# Altium project Design.PrjPcb
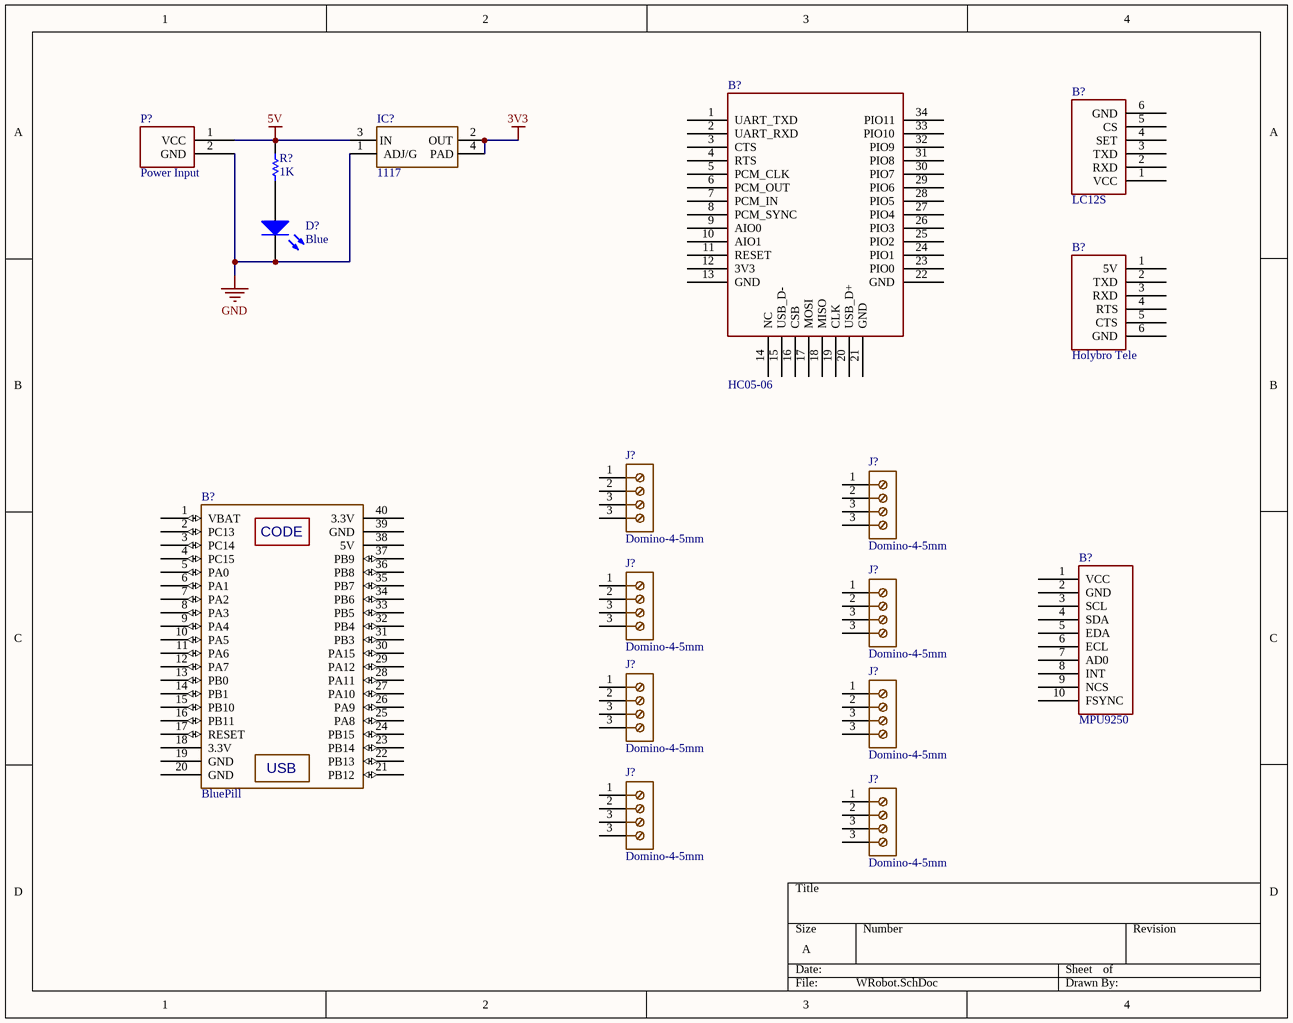
[diagram p0: WRobot.SchDoc]
1 sheet, 17 parts. Net scope: global (net labels, ports and power ports of the same name join across sheets).
Board file: WRobot.PcbDoc

## Sheet WRobot.SchDoc
size A

### Parts
(Parts that share a designator on the sheet are numbered #1, #2 ... from top to bottom, then left to right.)
B?#1  LC12S  [LC12S]
B?#2  Holybro Tele  [HOLYBRO_TELE]
B?#3  HC05-06  [HC05-06]
B?#4  MPU9250  [MPU9250]
B?#5  BluePill  [BlUEPILL]
D?  value Blue  [LED-3mm]  (hidden comment: LED-BLUE-TH-3mm)
IC?  1117  [SOT223]
J?#1  Domino-4-5mm  [DOMINO-4-5MM]
J?#2  Domino-4-5mm  [DOMINO-4-5MM]
J?#3  Domino-4-5mm  [DOMINO-4-5MM]
J?#4  Domino-4-5mm  [DOMINO-4-5MM]
J?#5  Domino-4-5mm  [DOMINO-4-5MM]
J?#6  Domino-4-5mm  [DOMINO-4-5MM]
J?#7  Domino-4-5mm  [DOMINO-4-5MM]
J?#8  Domino-4-5mm  [DOMINO-4-5MM]
P?  Power Input  [POWER_INPUT]
R?  value 1K  [RES-SM-0805]  (hidden comment: Res-1K-0805)

### Nets
3V3: IC?.2(OUT) IC?.4(PAD)
5V: IC?.3(IN) P?.1(VCC) R?.2
GND: D?.2(K) IC?.1(ADJ/G) P?.2(GND)
NetD?_1: D?.1(A) R?.1

Not connected (* = marked no-connect by the designer): B?#1 1(VCC) 2(RXD) 3(TXD) 4(SET) 5(CS) 6(GND); B?#2 1(5V) 2(TXD) 3(RXD) 4(RTS) 5(CTS) 6(GND); B?#3 1(UART_TXD) 2(UART_RXD) 3(CTS) 4(RTS) 5(PCM_CLK) 6(PCM_OUT) 7(PCM_IN) 8(PCM_SYNC) 9(AIO0) 10(AIO1) 11(RESET) 12(3V3) 13(GND) 14(NC) 15(USB_D-) 16(CSB) 17(MOSI) 18(MISO) 19(CLK) 20(USB_D+) 21(GND) 22(GND) 23(PIO0) 24(PIO1) 25(PIO2) 26(PIO3) 27(PIO4) 28(PIO5) 29(PIO6) 30(PIO7) 31(PIO8) 32(PIO9) 33(PIO10) 34(PIO11); B?#4 1(VCC) 2(GND) 3(SCL) 4(SDA) 5(EDA) 6(ECL) 7(AD0) 8(INT) 9(NCS) 10(FSYNC); B?#5 1(VBAT) 2(PC13) 3(PC14) 4(PC15) 5(PA0) 6(PA1) 7(PA2) 8(PA3) 9(PA4) 10(PA5) 11(PA6) 12(PA7) 13(PB0) 14(PB1) 15(PB10) 16(PB11) 17(RESET) 18(3.3V) 19(GND) 20(GND) 21(PB12) 22(PB13) 23(PB14) 24(PB15) 25(PA8) 26(PA9) 27(PA10) 28(PA11) 29(PA12) 30(PA15) 31(PB3) 32(PB4) 33(PB5) 34(PB6) 35(PB7) 36(PB8) 37(PB9) 38(5V) 39(GND) 40(3.3V); J?#1 1 2 3; J?#2 1 2 3; J?#3 1 2 3; J?#4 1 2 3; J?#5 1 2 3; J?#6 1 2 3; J?#7 1 2 3; J?#8 1 2 3

### Notes on the sheet
- (in symbol BluePill) CODE; USB

### Library data of the parts
D? = LED-BLUE-TH-3mm: LED BLUE CLEAR T-1 T/H; Manufacturer: Kingbright; Manufacturer Part Number: WP710A10QBC/D; Local Supplier: thegioiic; Local Supplier Link: https://thegioiic.com/products/led-xanh-duong-3mm-chan-dai; Supplier 1: Digikey; Supplier 1 Link: https://www.digikey.com/product-detail/en/kingbright/WP710A10QBC-D/754-1596-ND/2769812; Supplier 1 Part Number: 754-1596-ND
IC? = 1117: Available in 1.8V, 2.5V, 2.85V, 3.3V, 5V, and  Adjustable Versions; Value: LM317
J?#1-J?#8 = Domino-4-5mm: WR-TBL Serie 1347 Horizontal Cable Entry, Pressure Clamp, pitch 5mm, 3p; Part Number: 691134710003; Compliance: Lead free / RoHS; Modularity: Yes; PCB/Cable/Panel: PCB; Pin Number: 3; Rated Current [UL]: 16A; Working Voltage [UL]: 300VAC; ComponentLink1Description: Manufacturer; ComponentLink1URL: http://www.we-online.de; ComponentLink2URL: https://katalog.we-online.de/em/datasheet/691134710003.pdf; ComponentLink2Description: Datasheet; Mounting Technology: THT; Packaging: Box; Operating Temperature: -30 to +120degC; Pitch: 5mm; Published Date: October 2019; Type: Horizontal; Publisher: Wurth Elektronik; Application: Pressure Clamp
R? = Res-1K-0805: RES 1K OHM 1% 1/4W 0805; Manufacturer: Stackpole Electronics Inc; Manufacturer Part Number: RNCP0805FTD1K00; Local Supplier: thegioiic; Local Supplier Link: https://thegioiic.com/products/dien-tro-1k-ohm-0805-5; Supplier 1: Digikey; Supplier 1 Link: https://www.digikey.com/product-detail/en/stackpole-electronics-inc/RNCP0805FTD1K00/RNCP0805FTD1K00CT-ND/2240568; Supplier 1 Part Number: RNCP0805FTD1K00CT-ND